# Altium schematic sheet Arduino_hat.SchDoc
size A4; SheetNumber: 1; SheetTotal: 2
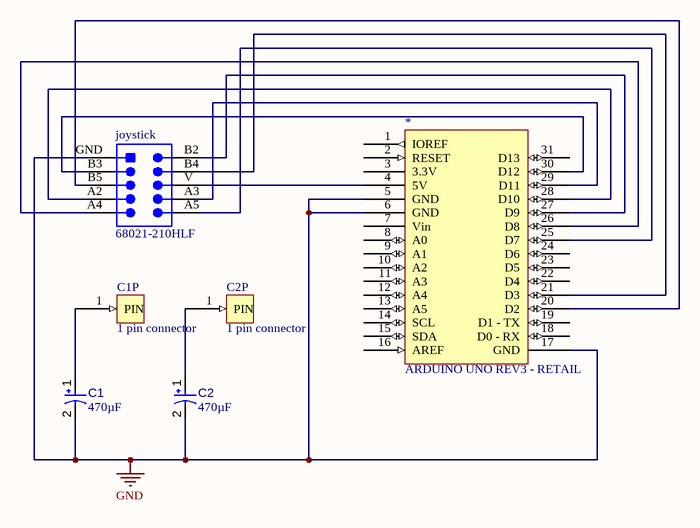
[diagram p0: Arduino_hat.SchDoc]

## Parts
*  ARDUINO UNO REV3 - RETAIL
C1  value 470µF  [CAPPR65-500-2000X1000X2200]  (hidden comment: ECA-1HM471)
C1P  1 pin connector
C2  value 470µF  [CAPPR65-500-2000X1000X2200]  (hidden comment: ECA-1HM471)
C2P  1 pin connector
joystick  68021-210HLF  [FCI-68021-210HLF-10_V]

## Nets
GND: *.5(GND) *.6(GND) *.17(GND) C1.2 C2.2 joystick.GND
Net*_4: *.4(5V) joystick.V
Net*_20: *.20(D2) joystick.B5
Net*_21: *.21(D3) joystick.B4
Net*_25: *.25(D7) joystick.A5
Net*_26: *.26(D8) joystick.A4
Net*_27: *.27(D9) joystick.B2
Net*_28: *.28(D10) joystick.A2
Net*_29: *.29(D11) joystick.A3
Net*_30: *.30(D12) joystick.B3
NetC1_1: C1.1 C1P.1(PIN)
NetC2_1: C2.1 C2P.1(PIN)

Not connected (* = marked no-connect by the designer): * 1(IOREF) 2(RESET) 3(3.3V) 7(Vin) 8(A0) 9(A1) 10(A2) 11(A3) 12(A4) 13(A5) 14(SCL) 15(SDA) 16(AREF) 18(D0_-_RX) 19(D1_-_TX) 22(D4) 23(D5) 24(D6) 31(D13)

## Library data of the parts
* = CMP-00000-1
C1 C2 = CMP-001-00032-8: Aluminum Electrolytic Capacitor, 470 uF, +/- 20%, 50 V, -40 to 85 degC, 2-Pin THD, RoHS, Bulk; Manufacturer: Panasonic; Ripple Current: 650mA; Voltage Rating: 50V; Ripple Current (AC): 650mA; Packaging: Bulk; Capacitor Type: Electrolytic; Diameter: 10mm; Datasheet URL: http://industrial.panasonic.com/cdbs/www-data/pdf/RDF0000/ABA0000C1047.pdf; Case/Package: Radial; Tolerance: 20%; Max Operating Temperature: 85°C; Pins: 2; Min Operating Temperature: -40°C; RoHS Compliant: True; Mounting Technology: TH; Package Quantity: 200; Lead Pitch: 5mm; Manufacturer URL: http://www.panasonic.com/; Package Description: 2-Pin Radial Lead, Dia 10 mm, Height 22 mm; Datasheet Version: Mar-16; Package Reference: CAPPR65-500-2000X1000X2200
C1P C2P = CMP-002-00596-1
joystick = CMP-002-00020-2: Male Header, Pitch 2.54 mm, 2 x 5 Position, Height 4.83 mm, Tail Length 3.05 mm, Bulk; Manufacturer: FCI Electronics; Datasheet URL: http://portal.fciconnect.com/Comergent//fci/drawing/68020.pdf; Case/Package: 68021-210HLF-10; Manufacturer URL: http://portal.fciconnect.com/; Connector Type: Header; Mounting Technology: TH; Datasheet Version: Rev. BM, 04/2015; Package Description: Male Header, Pitch 2.54 mm, 2 x 5 Position, Height 4.83 mm, Tail Length 3.05 mm; Gender: Male; RoHS Compliant: Unknown; Package Reference: 68021-210HLF-10